# EAGLE design DigiSporc_nano (EAGLE 6.2)
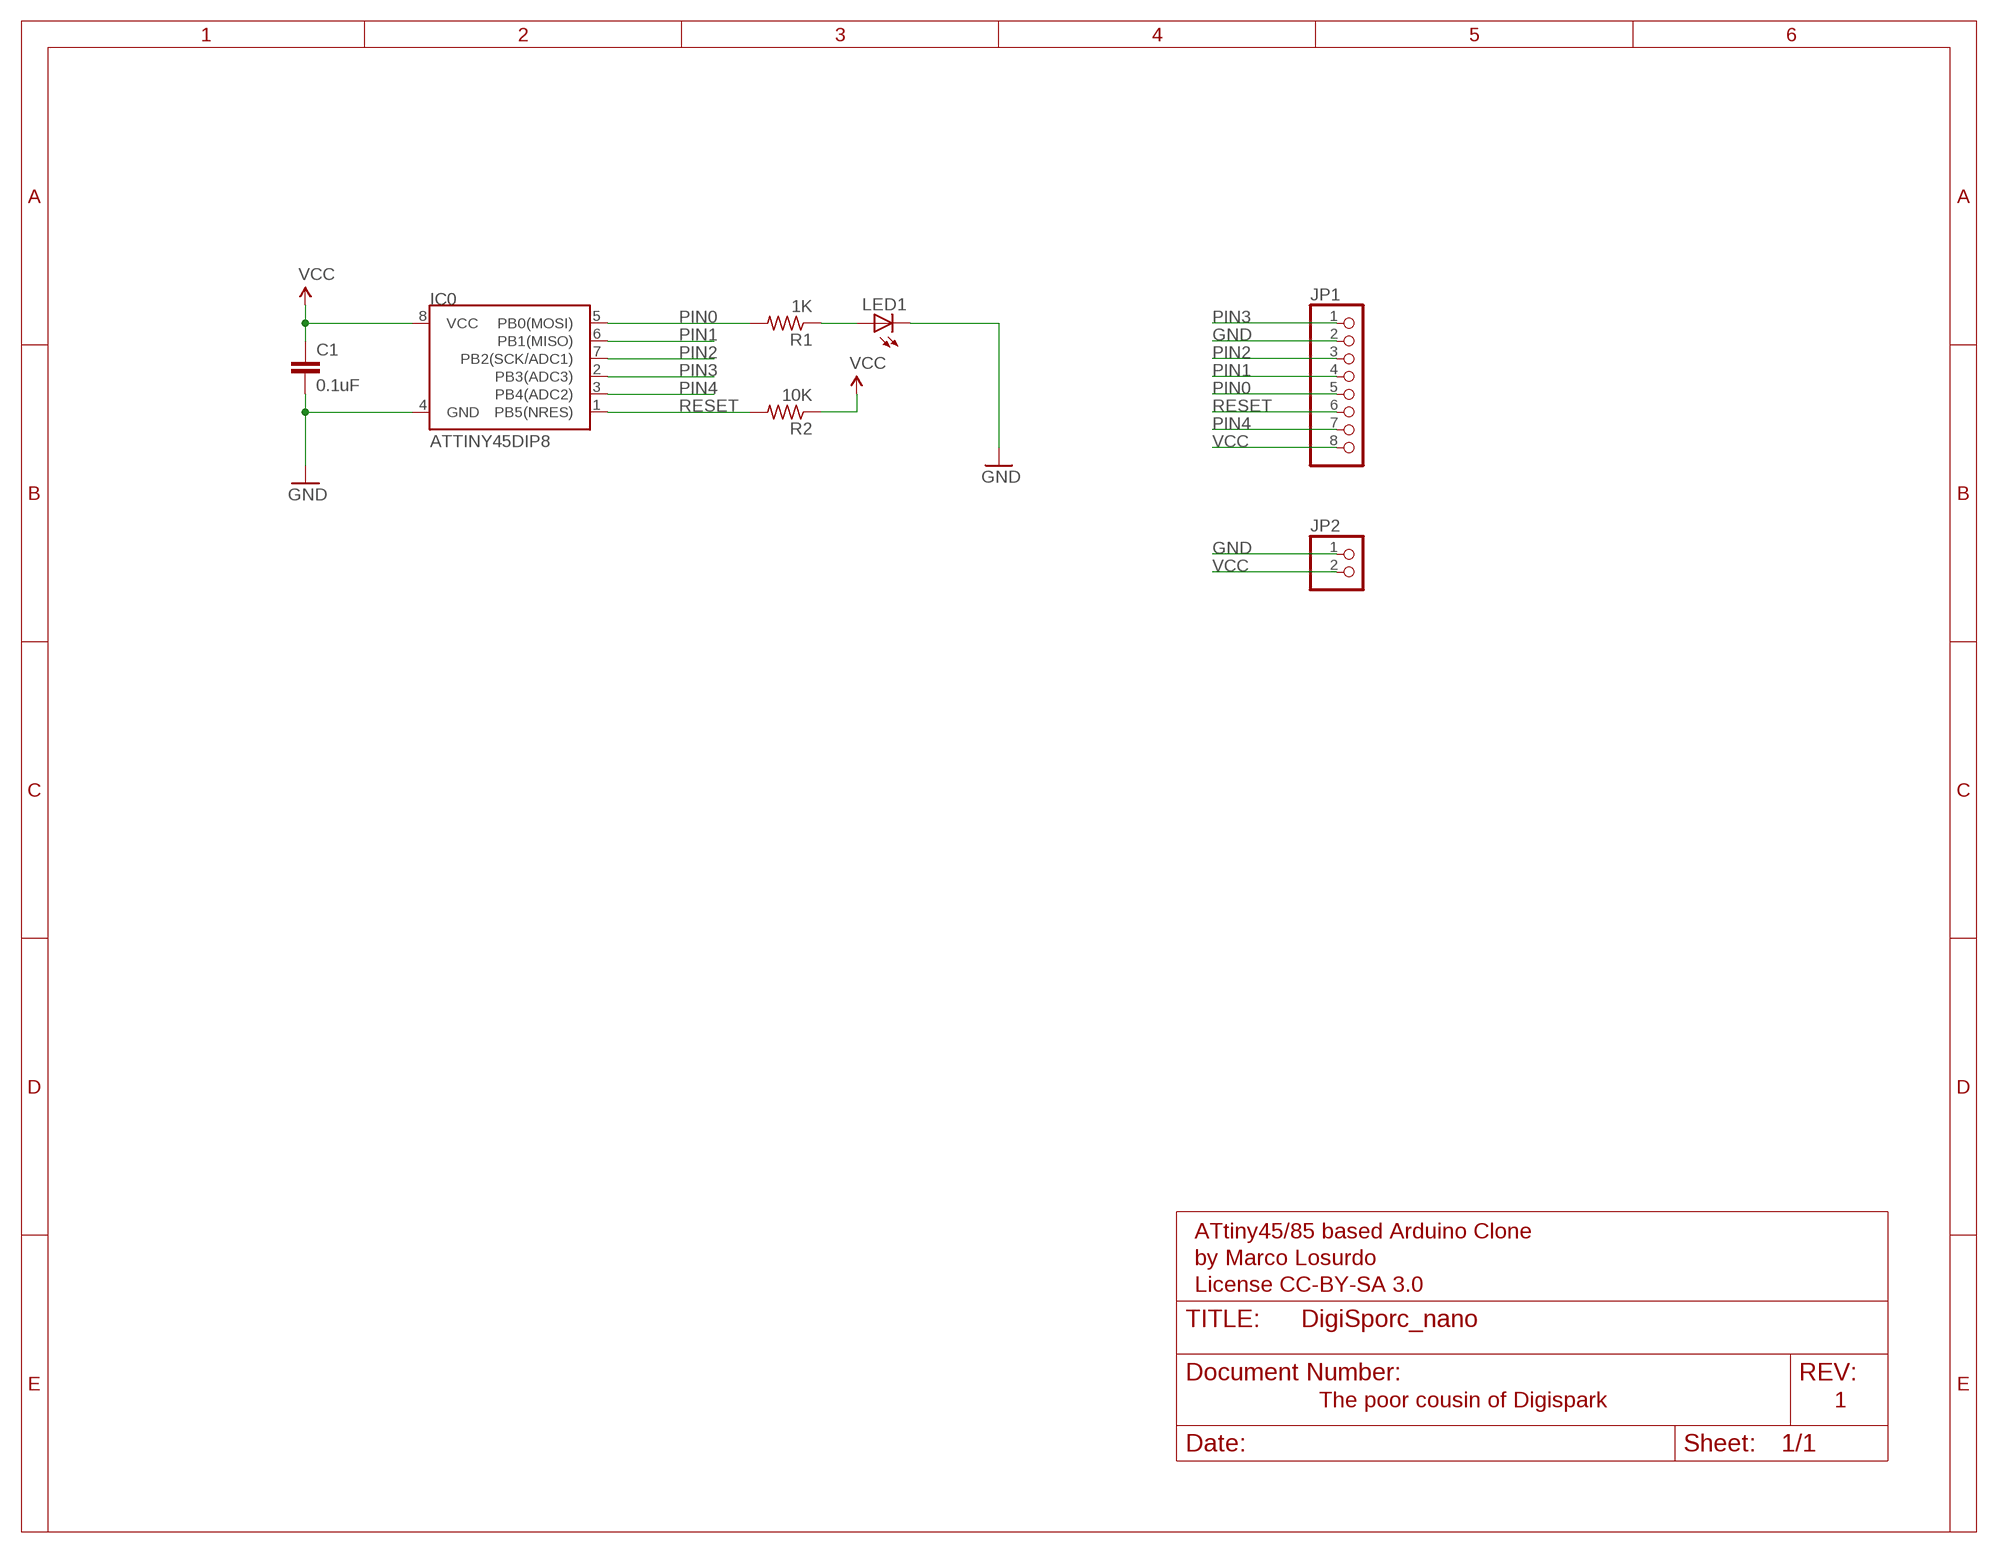
[diagram p0: schematic, sheet 1]

## Parts
C1  0.1uF  CAPPTH  [CAP-PTH-SMALL]
IC0  ATTINY45DIP8  [DIP08]
JP1  PINHD-1X8  [1X08]
JP2  PINHD-1X2  [1X02]
LED1  LED3MM  [LED3MM]
R1  1K  R-US_0204/7  [0204/7]
R2  10K  R-US_0204/7  [0204/7]

## Nets
GND: C1.2 IC0.4(GND) JP1.2 JP2.1 LED1.K(C)
N$5: LED1.A R1.1
PIN0: IC0.5(PB0(MOSI)) JP1.5 R1.2
PIN1: IC0.6(PB1(MISO)) JP1.4
PIN2: IC0.7(PB2(SCK/ADC1)) JP1.3
PIN3: IC0.2(PB3(ADC3)) JP1.1
PIN4: IC0.3(PB4(ADC2)) JP1.7
RESET: IC0.1(PB5(NRES)) JP1.6 R2.2
VCC: C1.1 IC0.8(VCC) JP1.8 JP2.2 R2.1

## Notes on the sheet
- ATtiny45/85 based Arduino Clone
- by Marco Losurdo
- License CC-BY-SA 3.0
- The poor cousin of Digispark | 1

## Library data of the parts
C1 = SparkFun:CAP: Capacitor Standard 0603 ceramic capacitor, and 0.1" leaded capacitor.
IC0 = SparkFun:ATTINY45: Atmel ATTiny45
JP1 = pinhead:PINHD-1X8: PIN HEADER
JP2 = pinhead:PINHD-1X2: PIN HEADER
LED1 = adafruit:LED: LED OSRAM: - CHIPLED LG R971, LG N971, LY N971, LG Q971, LY Q971, LO R971, LY R971 LH N974, LH R974 LS Q976, LO Q976, LY Q976 LO Q996 - Hyper CHIPLED LW Q18S LB Q993, LB Q99A, LB R99A - SideLED LS A670, LO A670, LY A670, LG A670, LP A670 LB A673, LV A673, LT A673, LW A673 LH A674 LY A675 LS A676, LA A676, LO A676, LY A676, LW A676 LS A679, LY A679, LG A679 - Hyper Micro SIDELED® LS Y876, LA Y876, LO Y876, LY Y876 LT Y87S - SmartLED LW L88C, LW L88S LB L89C, LB L89S, LG L890 LS L89K, LO L89K, LY L89K LS L896, LA L896, LO L896, LY L896 - TOPLED LS T670, LO T670, LY T670, LG T670, LP T670 LSG T670, LSP T670, LSY T670, LOP T670, LYG T670 LG T671, LOG T671, LSG T671 LB T673, LV T673, LT T673, LW T673 LH T674 LS T676, LA T676, LO T676, LY T676, LB T676, LH T676, LSB T676, LW T676 LB T67C, LV T67C, LT T67C, LS T67K, LO T67K, LY T67K, LW E67C LS E67B, LA E67B, LO E67B, LY E67B, LB E67C, LV E67C, LT E67C LW T67C LS T679, LY T679, LG T679 LS T770, LO T770, LY T770, LG T770, LP T770 LB T773, LV T773, LT T773, LW T773 LH T774 LS E675, LA E675, LY E675, LS T675 LS T776, LA T776, LO T776, LY T776, LB T776 LHGB T686 LT T68C, LB T68C - Hyper Mini TOPLED® LB M676 - Mini TOPLED Santana® LG M470 LS M47K, LO M47K, LY M47K Source: http://www.osram.convergy.de/
R1 R2 = adafruit:R-US_: RESISTOR, American symbol

## Board
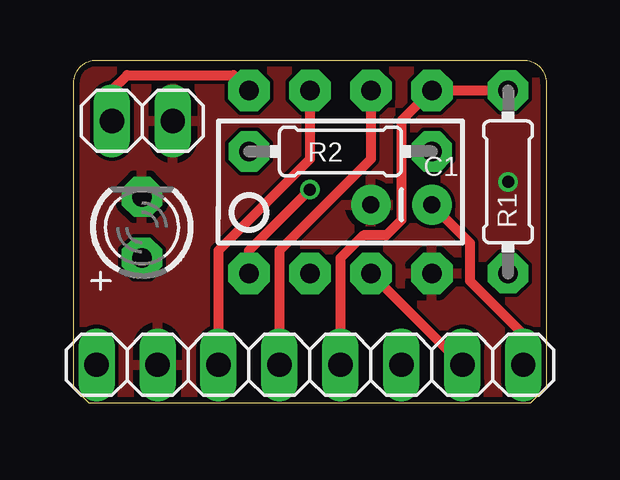
[diagram p1: board, top side]
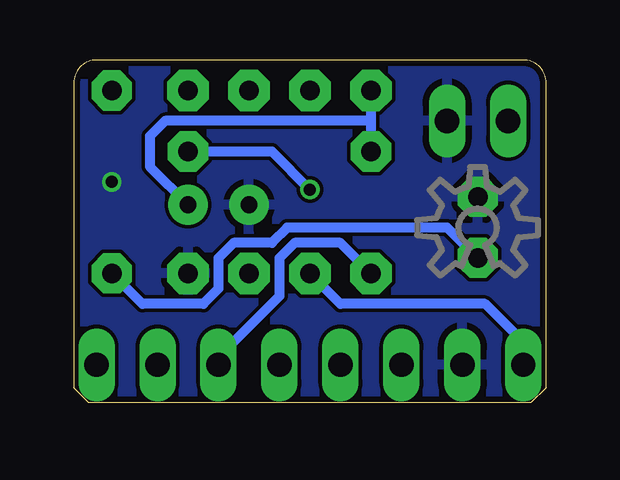
[diagram p2: board, bottom side, seen from below]

Size 19.69 x 14.29 mm. Coordinates in mm from the lower left corner, seen from the top.
Outline: 0,0.63 0.63,0 19.05,0 19.69,0.63 19.69,13.34 arc90 18.73,14.29 0.95,14.29 arc90 0,13.34 0,0.63
Copper layers (1*16): Top 0.035mm / dielectric 1.5mm / Bottom 0.035mm
Design rules: minimum track width 6mil, minimum drill 12mil, track to track 6mil, track to pad 6mil, pad to pad 6mil, via to via 6mil, smd to smd 0mil, copper to edge 10mil, drill to drill 10mil, minimum pad ring 10mil, minimum via ring 6mil, stop-mask expansion 2mil, vias tented up to drill 100mil, thermal gap 10mil

### Footprints (pad centres in the part's own frame; a part is rotated, then mirrored left to right if it is on the bottom)
CAP-PTH-SMALL = drill 0.7 pad 1.651: 1 0,0; 2 2.54,0
DIP08 = drill 0.813 pad 1.727 octagon: 1 -3.81,-3.81; 2 -1.27,-3.81; 3 1.27,-3.81; 4 3.81,-3.81; 5 3.81,3.81; 6 1.27,3.81; 7 -1.27,3.81; 8 -3.81,3.81
1X08 = drill 1.016 long: 1 -8.89,0; 2 -6.35,0; 3 -3.81,0; 4 -1.27,0; 5 1.27,0; 6 3.81,0; 7 6.35,0; 8 8.89,0
1X02 = drill 1.016 long: 1 -1.27,0; 2 1.27,0
LED3MM = drill 0.813 pad 1.676 octagon: A -1.27,0; K 1.27,0
0204/7 = drill 0.813 pad 1.676 octagon: 1 -3.81,0; 2 3.81,0

### Placement (x,y rotation side)
C1  14.92,8.25 180 top
IC0  11.11,9.21 0 top
JP1  9.84,1.59 0 top
JP2  2.86,11.75 180 top
LED1  2.84,7.32 90 top
R1  18.1,9.21 90 top
R2  11.11,10.48 0 top
U$1  [OSHWLOGO_TOL_0.2]  2.86,7.3 0 bottom

### Tracks (layer width: path | path; a pad name or v marks a point on that pad's centre or on a via)
GND  (via drill 0.5)
  other vias: 18.1,9.21
  pour Bottom: -3.81,18.1 23.18,18.1 23.18,-4.13 -3.81,-4.13
  pour Top: -1.91,16.19 21.91,16.19 21.91,-2.54 -1.91,-2.54
N$5
  Bottom 0.406: LED1.A 2.87,6.04 4.13,7.3 10.79,7.3 11.43,6.67 13.02,6.67 13.65,6.03 13.65,4.76 14.29,4.13 16.83,4.13 R1.1
PIN0
  Top 0.406: R1.2 IC0.5 13.65,11.75 13.65,7.62 13.02,6.98 12.06,6.98 11.11,6.03 JP1.5
PIN1
  Top 0.406: IC0.6 12.38,10.16 8.57,6.35 JP1.4
PIN2
  Top 0.406: IC0.7 9.84,10.16 6.03,6.35 JP1.3
PIN3
  Bottom 0.406: JP1.1 0.95,2.54 2.54,4.13 8.57,4.13 IC0.2
PIN4
  Top 0.406: IC0.3 JP1.7
RESET  (via drill 0.5)
  Top 0.406: v9.84,8.89 7.3,6.35 IC0.1
  Bottom 0.406: IC0.1 8.57,6.67 10.48,6.67 11.11,6.03 11.11,4.45 13.65,1.9 JP1.6 | R2.2 11.43,10.48 v9.84,8.89
VCC
  Top 0.406: JP2.2 1.59,13.02 2.22,13.65 6.67,13.65 IC0.8 | C1.1 16.51,6.67 16.51,5.08 18.73,2.86 JP1.8
  Bottom 0.406: IC0.8 7.3,11.75 | 7.3,11.75 15.88,11.75 16.51,11.11 16.51,9.84 C1.1 | 7.3,11.75 R2.1

### Text on the board
tDocu: 5V | GND | 3 | GND | 2 | 1 | 0 | RST | 5V | 4